# Altium schematic sheet Water_SCH.SchDoc: Блок управления
size 420 x 297 mm; ApprovedBy: Мешков; CheckedBy: Черноскутов; Author: Самойлов; CompanyName: РГППУ; Title2str: водой; DecimalNumber: АБВГ.123456.001 33
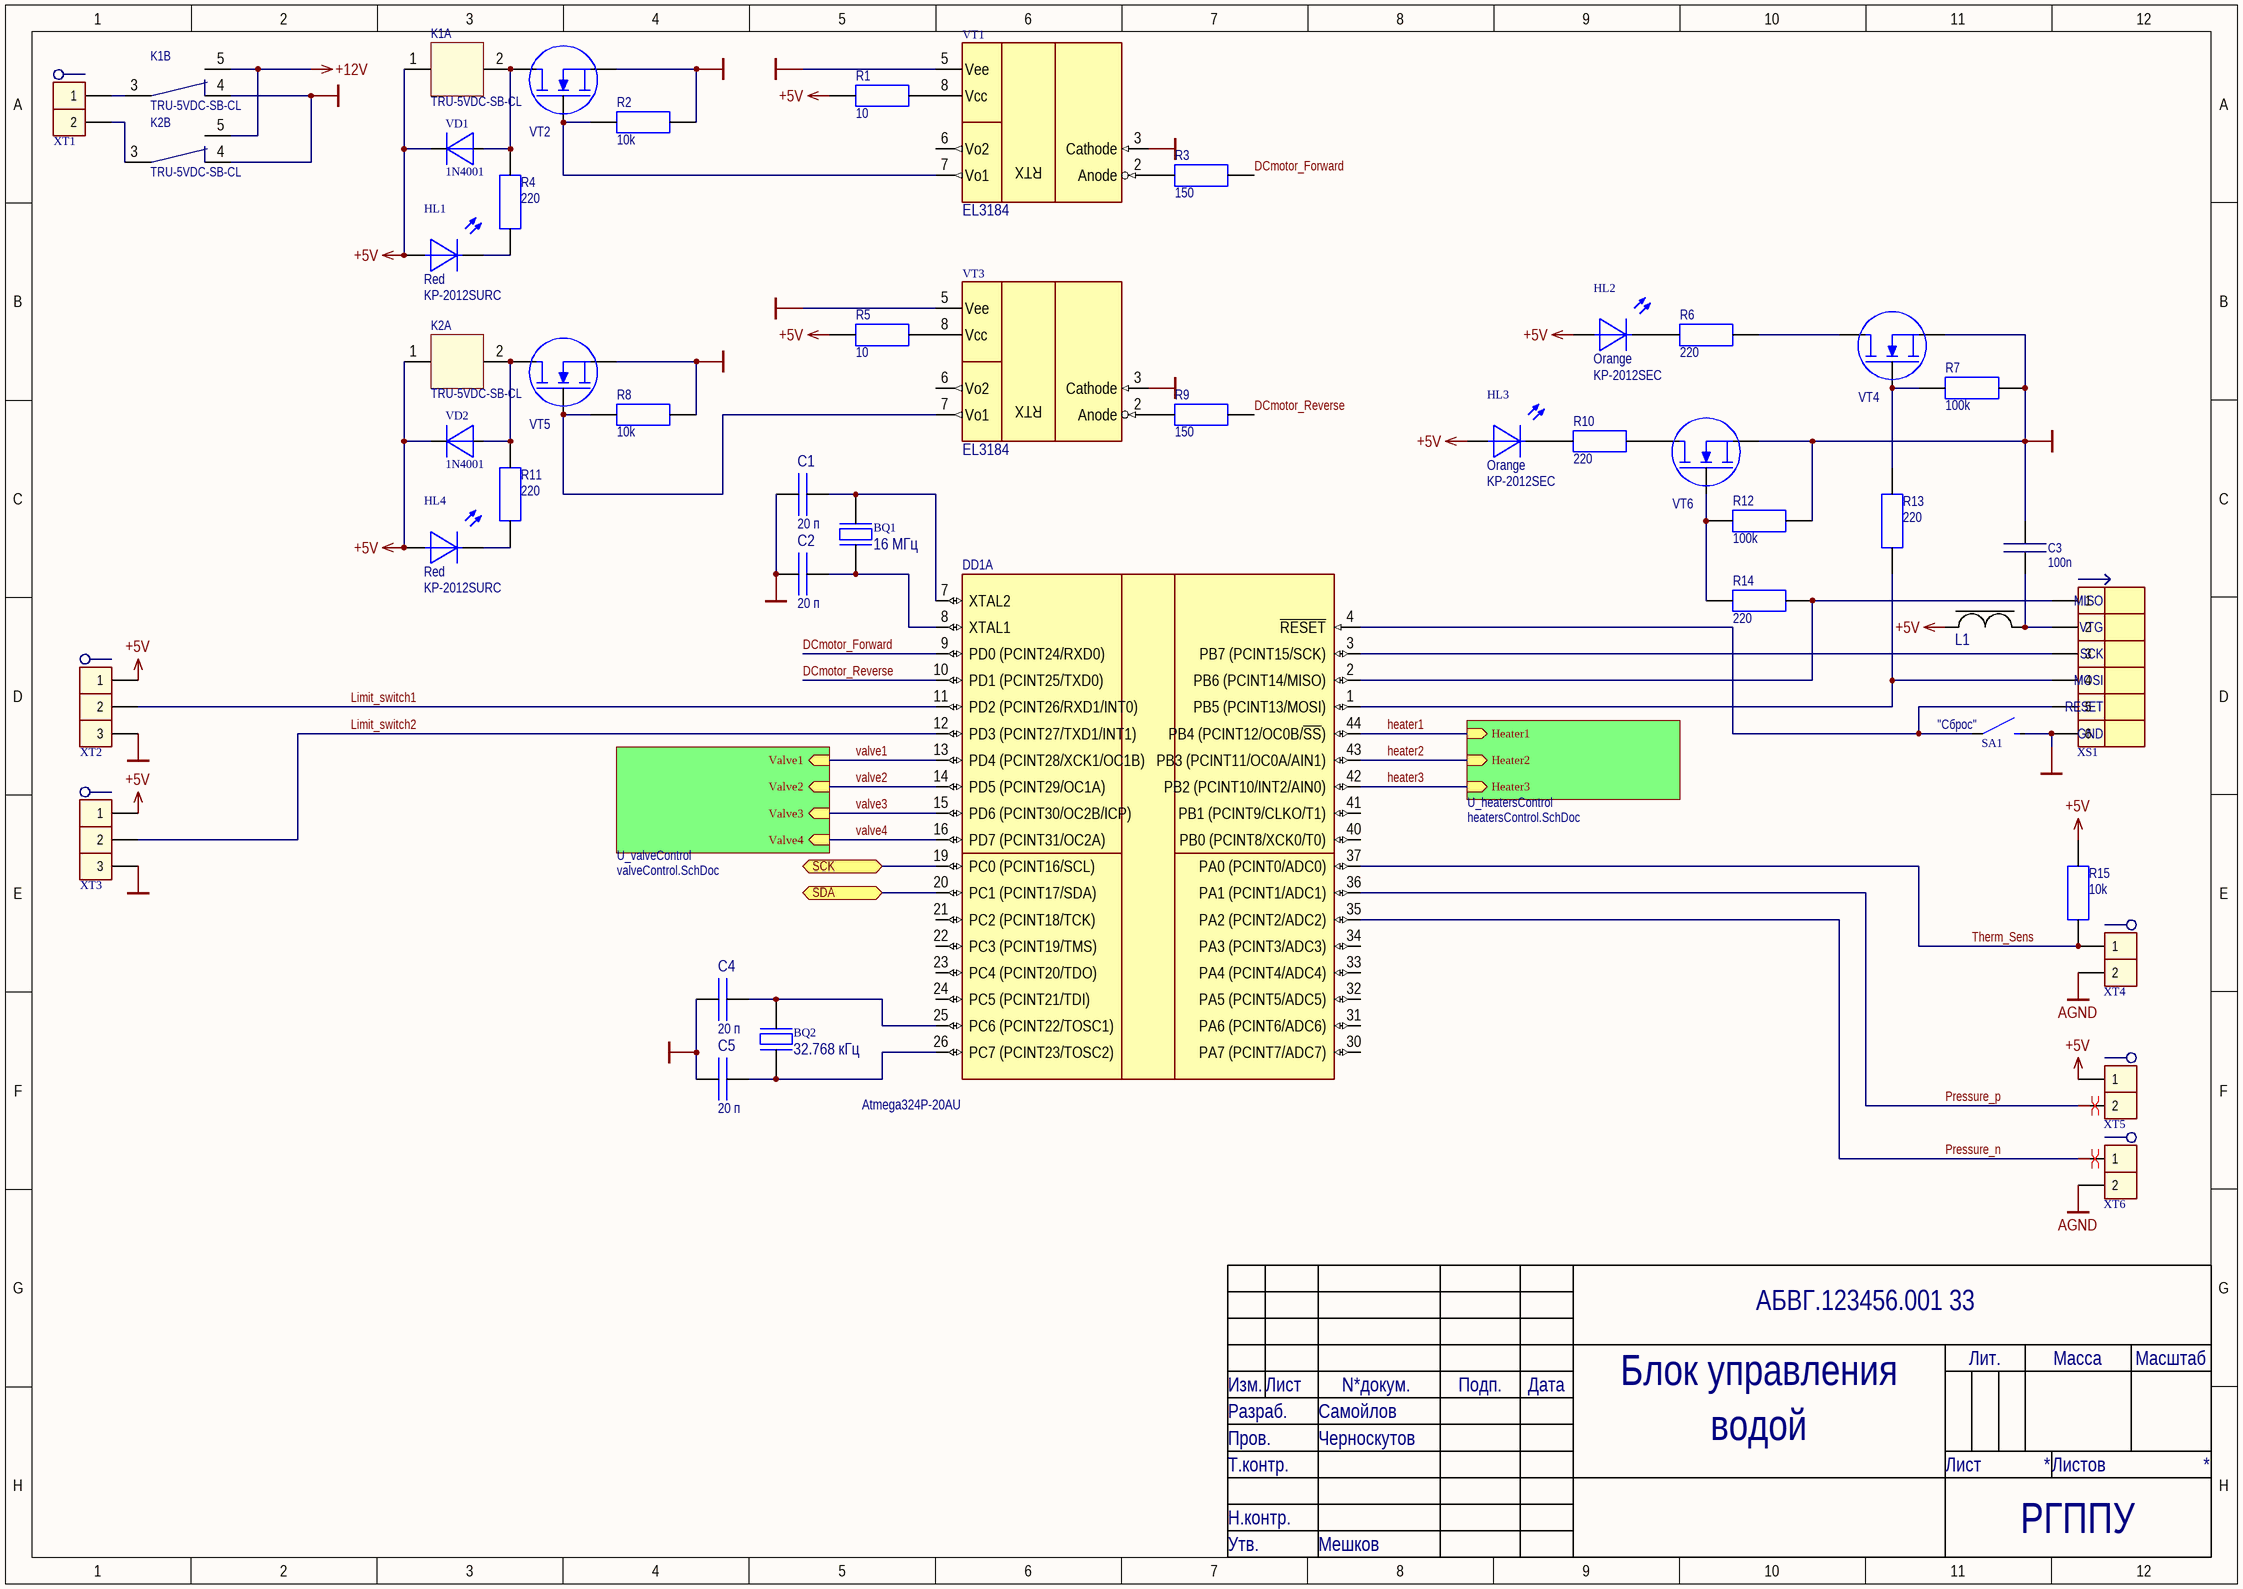
[diagram p0: Water_SCH.SchDoc]

## Parts
BQ1  16 МГц  [HC-49/S]
BQ2  32.768 кГц  [HC-49/S]
C1  value 20 п  [CAPC3216X05M]  (hidden comment: CC0603JRNP09BN200)
C2  value 20 п  [CAPC3216X05M]  (hidden comment: CC0603JRNP09BN200)
C3  100n  [SMDRC0805]
C4  value 20 п  [CAPC3216X05M]  (hidden comment: CC0603JRNP09BN200)
C5  value 20 п  [CAPC3216X05M]  (hidden comment: CC0603JRNP09BN200)
DD1  Atmega324P-20AU  [44ML_M]  (part A of 2)
HL1  Red  ManufacturerPartNumber: KP-2012SURC  [DIOMELF2012M]
HL2  Orange  ManufacturerPartNumber: KP-2012SEC  [DIOMELF2012M]
HL3  Orange  ManufacturerPartNumber: KP-2012SEC  [DIOMELF2012M]
HL4  Red  ManufacturerPartNumber: KP-2012SURC  [DIOMELF2012M]
K1  TRU-5VDC-SB-CL  [TRU-5VDC-SB-CL]  (parts A,B of 2)
K2  TRU-5VDC-SB-CL  [TRU-5VDC-SB-CL]  (parts A,B of 2)
L1  MPZ1608S181A  [INDC0603X03M]  (value not drawn)
R1  10  [SMDRC0805]
R2  10k  [SMDRC0805]
R3  150  [SMDRC0805]
R4  220  [SMDRC0805]
R5  10  [SMDRC0805]
R6  220  [SMDRC0805]
R7  100k  [SMDRC0805]
R8  10k  [SMDRC0805]
R9  150  [SMDRC0805]
R10  220  [SMDRC0805]
R11  220  [SMDRC0805]
R12  100k  [SMDRC0805]
R13  220  [SMDRC0805]
R14  220  [SMDRC0805]
R15  10k  [SMDRC0805]
SA1  DTSM20-4.3  [DTSM20]  (value not drawn)
VD1  1N4001  [PinDiode]
VD2  1N4001  [PinDiode]
VT1  EL3184  [DIP8]
VT2  2N7002  [SOT23 (TO-236AB)]  (value not drawn)
VT3  EL3184  [DIP8]
VT4  2N7002  [SOT23 (TO-236AB)]  (value not drawn)
VT5  2N7002  [SOT23 (TO-236AB)]  (value not drawn)
VT6  2N7002  [SOT23 (TO-236AB)]  (value not drawn)
XS1  IDC-06M  [IDC-06M]  (value not drawn)
XT1  330-021-12  [330-021-12]  (value not drawn)
XT2  330-031-12  [330-031-12]  (value not drawn)
XT3  330-031-12  [330-031-12]  (value not drawn)
XT4  330-021-12  [330-021-12]  (value not drawn)
XT5  330-021-12  [330-021-12]  (value not drawn)
XT6  330-021-12  [330-021-12]  (value not drawn)

## Sub-sheets
U_heatersControl = heatersControl.SchDoc: Heater1 (in), Heater2 (in), Heater3 (in)
U_valveСontrol = valveСontrol.SchDoc: Valve1 (in), Valve2 (in), Valve3 (in), Valve4 (in)

## Ports
SCK (bidir), SDA (bidir)

## Nets
+5V: HL1.1 HL2.1 HL3.1 HL4.1 K1.1 K2.1 L1.1 R1.2 R5.2 R15.2 VD1.K VD2.K XT2.1 XT3.1 XT5.1
+12V: K1.5 K2.5
AGND: XT4.2 XT6.2
GND: C1.2 C2.2 C3.2 C4.2 C5.2 K1.4 K2.4 R2.2 R7.2 R8.2 R12.2 SA1.2 VT1.3(Cathode) VT1.5(Vee) VT2.2(S) VT3.3(Cathode) VT3.5(Vee) VT4.2(S) VT5.2(S) VT6.2(S) XS1.6 XT2.3 XT3.3
DCmotor_Forward: DD1.9(PD0_(PCINT24/RXD0)) R3.1
DCmotor_Reverse: DD1.10(PD1_(PCINT25/TXD0)) R9.1
heater1: DD1.44(PB4_(PCINT12/OC0B/~{SS})) ; sheet U_heatersControl/Heater1
heater2: DD1.43(PB3_(PCINT11/OC0A/AIN1)) ; sheet U_heatersControl/Heater2
heater3: DD1.42(PB2_(PCINT10/INT2/AIN0)) ; sheet U_heatersControl/Heater3
Limit_switch1: DD1.11(PD2_(PCINT26/RXD1/INT0)) XT2.2
Limit_switch2: DD1.12(PD3_(PCINT27/TXD1/INT1)) XT3.2
Pressure_n: DD1.35(PA2_(PCINT2/ADC2)) XT6.1
Pressure_p: DD1.36(PA1_(PCINT1/ADC1)) XT5.2
SCK: DD1.19(PC0_(PCINT16/SCL)) ; port SCK
SDA: DD1.20(PC1_(PCINT17/SDA)) ; port SDA
Therm_Sens: DD1.37(PA0_(PCINT0/ADC0)) R15.1 XT4.1
valve1: DD1.13(PD4_(PCINT28/XCK1/OC1B)) ; sheet U_valveСontrol/Valve1
valve2: DD1.14(PD5_(PCINT29/OC1A)) ; sheet U_valveСontrol/Valve2
valve3: DD1.15(PD6_(PCINT30/OC2B/ICP)) ; sheet U_valveСontrol/Valve3
valve4: DD1.16(PD7_(PCINT31/OC2A)) ; sheet U_valveСontrol/Valve4
NetBQ1_1: BQ1.1 C2.1 DD1.8(XTAL1)
NetBQ1_2: BQ1.2 C1.1 DD1.7(XTAL2)
NetBQ2_1: BQ2.1 C5.1 DD1.26(PC7_(PCINT23/TOSC2))
NetBQ2_2: BQ2.2 C4.1 DD1.25(PC6_(PCINT22/TOSC1))
NetC3_1: C3.1 L1.2 XS1.2
NetDD1_1: DD1.1(PB5_(PCINT13/MOSI)) R13.1 XS1.4
NetDD1_2: DD1.2(PB6_(PCINT14/MISO)) R14.1 XS1.1
NetDD1_3: DD1.3(PB7_(PCINT15/SCK)) XS1.3
NetDD1_4: DD1.4(~{RESET}) SA1.1 XS1.5
NetHL1_2: HL1.2 R4.2
NetHL2_2: HL2.2 R6.2
NetHL3_2: HL3.2 R10.2
NetHL4_2: HL4.2 R11.2
NetK1_2: K1.2 R4.1 VD1.A VT2.3(D)
NetK1_3: K1.3 XT1.1
NetK2_2: K2.2 R11.1 VD2.A VT5.3(D)
NetK2_3: K2.3 XT1.2
NetR1_1: R1.1 VT1.8(Vcc)
NetR2_1: R2.1 VT1.7(Vo1) VT2.1(G)
NetR3_2: R3.2 VT1.2(Anode)
NetR5_1: R5.1 VT3.8(Vcc)
NetR6_1: R6.1 VT4.3(D)
NetR7_1: R7.1 R13.2 VT4.1(G)
NetR8_1: R8.1 VT3.7(Vo1) VT5.1(G)
NetR9_2: R9.2 VT3.2(Anode)
NetR10_1: R10.1 VT6.3(D)
NetR12_1: R12.1 R14.2 VT6.1(G)

Not connected (* = marked no-connect by the designer): DD1 21(PC2_(PCINT18/TCK)) 22(PC3_(PCINT19/TMS)) 23(PC4_(PCINT20/TDO)) 24(PC5_(PCINT21/TDI)) 30(PA7_(PCINT7/ADC7)) 31(PA6_(PCINT6/ADC6)) 32(PA5_(PCINT5/ADC5)) 33(PA4_(PCINT4/ADC4)) 34(PA3_(PCINT3/ADC3)) 40(PB0_(PCINT8/XCK0/T0)) 41(PB1_(PCINT9/CLKO/T1)); VT1 6(Vo2); VT3 6(Vo2)

## Layout directives
differential pair: Pressure_n, Pressure_p

## Notes on the sheet
- (near SA1) "Сброс"
- Изм.
- Лист
- N*докум.
- Подп.
- Дата
- Лит.
- Масса
- Масштаб
- Разраб.
- Пров.
- Т.контр.
- Лиcт
- Лиcтов
- Н.контр.
- Утв.
- (in symbol Con6_M IDC-06M_SPI) MISO; VTG; SCK; MOSI; RESET; GND
- (in symbol EL3184) RTX

## Library data of the parts
BQ1 BQ2 = Piezoelectric_16000: Piezoelectric elements; Manufacturer: Taizhou; ManufacturerPartNumber: 16000 кГц 20ppm 20pF; ComponentLink1URL: http://www.promelec.ru/catalog_info/54/126/246/70/; ComponentLink1Description: Datasheet; Package: HC-49/S; Cost: 8,54; Supplier: Промэлектроника; ComponentLink2Description: Datasheet-local
  BQ1: Value: 16 МГц
  BQ2: Value: 32.768 кГц
C1 C2 C4 C5 = p00020_050: 20pF Bipolar cap; Manufacturer: Yageo; ManufacturerPartNumber: CC0603JRNP09BN200; Supplier: Промэлектроника; Cost: 0,34; Package: 0603; ComponentLink1Description: Datasheet; ComponentLink1URL: http://www.yageo.com/documents/recent/UPY-GPHC_X5R_4V-to-50V_v16.pdf; ComponentLink2Description: Datasheet-local; ComponentLink2URL: *
C3 = Capacitor 0805 100n: Generic capasitor non-polar; PartNumber: Capacitor 0805 100n; Value: 100n; ComponentLink1Description: Datasheet; Package: 0805
DD1 = Atmega324P-20AU: Microcontroller 8-bit; Manufacturer: Atmel; ComponentLink1URL: http://www.atmel.com/Images/Atmel-8011-8-bit-AVR-Microcontroller-ATmega164P-324P-644P_datasheet.pdf; ComponentLink1Description: Datasheet; Cost: 220; Package: TQFP-44; Supplier: Промэлектроника; ManufacturerPartNumber: Atmega324P-20AU
HL1 HL4 = LED1_R: Diod LED SMD Red; ComponentLink1Description: Datasheet; Cost: 5,01; ComponentLink2Description: Datasheet-local; ComponentLink2URL: *; Color: Red
HL2 HL3 = LED1_O: Diod LED SMD Orange; ComponentLink1Description: Datasheet; Cost: 4,91; ComponentLink2Description: Datasheet-local; ComponentLink2URL: *; Color: Orange
L1 = Ferrite Bead: Value: ? мГн; ManufacturerPartNumber: MPZ1608S181A; ComponentLink1Description: Datasheet; Supplier: Промэлектроника; ComponentLink2Description: Datasheet-local; ComponentLink2URL: *
R1 R5 = Resistor 0805 10: Generic resistor; PartNumber: Resistor 0805 10; Value: 10; ComponentLink1URL: http://www.mouser.com/ds/2/447/PYu-RC0402_51_RoHS_L_6_r-8721.pdf; ComponentLink1Description: Datasheet; Package: 0805
R2 R8 R15 = Resistor 0805 10k: Generic resistor; PartNumber: Resistor 0805 10k; Value: 10k; ComponentLink1URL: http://www.mouser.com/ds/2/447/PYu-RC0402_51_RoHS_L_6_r-8721.pdf; ComponentLink1Description: Datasheet; Package: 0805
R3 R9 = Resistor 0805 150: Generic resistor; PartNumber: Resistor 0805 150; Value: 150; ComponentLink1URL: http://www.mouser.com/ds/2/447/PYu-RC0402_51_RoHS_L_6_r-8721.pdf; ComponentLink1Description: Datasheet; Package: 0805
R4 R6 R10 R11 R13 R14 = Resistor 0805 220: Generic resistor; PartNumber: Resistor 0805 220; Value: 220; ComponentLink1URL: http://www.mouser.com/ds/2/447/PYu-RC0402_51_RoHS_L_6_r-8721.pdf; ComponentLink1Description: Datasheet; Package: 0805
R7 R12 = Resistor 0805 100k: Generic resistor; PartNumber: Resistor 0805 100k; Value: 100k; ComponentLink1URL: http://www.mouser.com/ds/2/447/PYu-RC0402_51_RoHS_L_6_r-8721.pdf; ComponentLink1Description: Datasheet; Package: 0805
SA1 = Switch1_DTSM20-4.3: Switch open; Manufacturer: Diptronics; ManufacturerPartNumber: DTSM20-4.3; ComponentLink1Description: Datasheet; ComponentLink1URL: http://www.promelec.ru/catalog/407/1291/1323/1/70721/; ComponentLink2Description: Datasheet-local; ComponentLink2URL: *
VD1 VD2 = 1N4001: Rectifying diode; ComponentLink1Description: Datasheet; ComponentLink1URL: http://www.promelec.ru/pdf/1N400x.pdf; Cost: 5; Package: штырьевой; ComponentLink2Description: Datasheet-local; ComponentLink2URL: *; ManufacturerPartNumber: 1N4001
VT1 VT3 = EL3184: Optocouple IGBT driver; Manufacturer: Everlight Electronics Co. Ltd; Package: DIP-8; ComponentLink1URL: http://www.promelec.ru/pdf/EL3184-EVLT.pdf; ComponentLink1Description: Datasheet; Cost: 66,38; Supplier: Промэлектроника; ManufacturerPartNumber: EL3184
VT2 VT4-VT6 = 2N7002 n-MOSFET: 60V, 300mA N-channel Trench MOSFET; ManufacturerPartNumber: 2N7002
XS1 = Con6_M IDC-06M_SPI: SPI connector; ManufacturerPartNumber: IDC-06M; ComponentLink1Description: Datasheet; ComponentLink1URL: http://www.promelec.ru/catalog/406/1218/1223/1/156430/; ComponentLink2Description: Datasheet-local; ComponentLink2URL: *
XT1 XT4-XT6 = Con2_D 330-021-12: Demountable connection  2-pin; Manufacturer: Degson Electronics Co., Ltd; ManufacturerPartNumber: 330-021-12; ComponentLink1Description: Datasheet; Cost: 7,45; Supplier: Промэлектроника; ComponentLink2Description: Datasheet-local
XT2 XT3 = Con3_D 330-031-12: Demountable connection 3-pin; Manufacturer: Degson Electronics Co., Ltd; ManufacturerPartNumber: 330-031-12; ComponentLink1Description: Datasheet; Cost: 13; Supplier: Промэлектроника; ComponentLink2Description: Datasheet-local
K1 K2 = TRU-5VDC-SB-CL: ManufacturerPurtNumber: TRU-5VDC-SB-CL